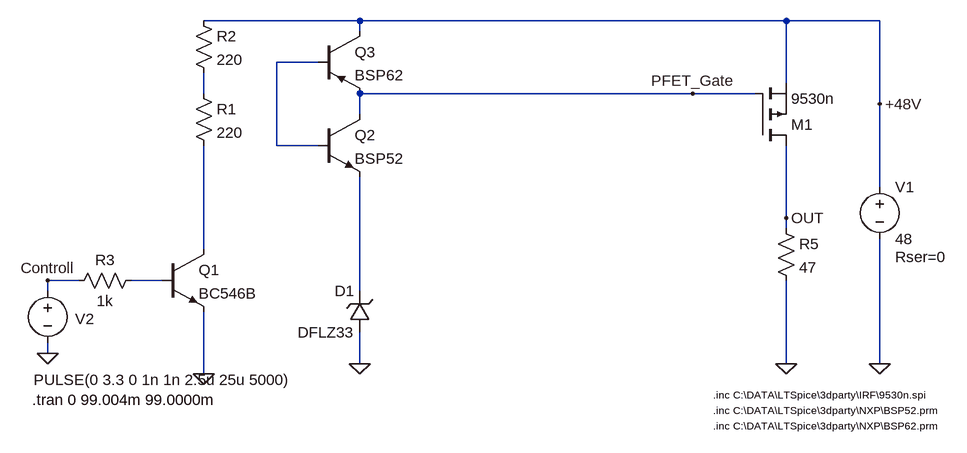
[diagram p0: schematic test002.asc]
test002.asc, the LTspice schematic file:
Version 4
SHEET 1 908 680
WIRE -144 -128 -384 -128
WIRE 512 -128 -144 -128
WIRE 656 -128 512 -128
WIRE -144 -112 -144 -128
WIRE -208 -64 -272 -64
WIRE 512 -32 512 -128
WIRE -384 -16 -384 -48
WIRE 368 -16 -144 -16
WIRE 464 -16 368 -16
WIRE 656 0 656 -128
WIRE -144 16 -144 -16
WIRE -272 64 -272 -64
WIRE -208 64 -272 64
WIRE 656 128 656 0
WIRE 512 176 512 64
WIRE 512 192 512 176
WIRE -384 224 -384 64
WIRE -576 272 -624 272
WIRE -448 272 -496 272
WIRE -624 288 -624 272
WIRE -144 288 -144 112
WIRE -624 384 -624 368
WIRE -144 400 -144 352
WIRE 512 400 512 272
WIRE 656 400 656 208
WIRE -384 416 -384 320
FLAG -144 400 0
FLAG 512 400 0
FLAG 656 400 0
FLAG -624 384 0
FLAG 656 0 +48V
FLAG -624 272 Controll
FLAG 512 176 OUT
FLAG 368 -16 PFET_Gate
FLAG -384 416 0
SYMBOL pmos 464 64 M180
SYMATTR InstName M1
SYMATTR Value 9530n
SYMATTR Prefix X
SYMBOL npn -208 16 R0
SYMATTR InstName Q2
SYMATTR Value BSP52
SYMATTR Prefix X
SYMBOL res 496 176 R0
SYMATTR InstName R5
SYMATTR Value 47
SYMBOL voltage 656 112 R0
WINDOW 123 0 0 Left 2
WINDOW 39 24 124 Left 2
SYMATTR SpiceLine Rser=0
SYMATTR InstName V1
SYMATTR Value 48
SYMBOL voltage -624 272 R0
WINDOW 0 42 59 Left 2
WINDOW 3 -22 153 Left 2
WINDOW 123 0 0 Left 2
WINDOW 39 0 0 Left 2
SYMATTR InstName V2
SYMATTR Value PULSE(0 3.3 0 1n 1n 2.5u 25u 5000)
SYMBOL zener -128 352 R180
WINDOW 0 24 64 Left 2
WINDOW 3 24 0 Left 2
SYMATTR InstName D1
SYMATTR Value DFLZ33
SYMATTR Description Diode
SYMATTR Type diode
SYMBOL pnp -208 -112 R0
SYMATTR InstName Q3
SYMATTR Value BSP62
SYMATTR Prefix X
SYMBOL res -400 -144 R0
SYMATTR InstName R2
SYMATTR Value 220
SYMBOL res -400 -32 R0
SYMATTR InstName R1
SYMATTR Value 220
SYMBOL npn -448 224 R0
SYMATTR InstName Q1
SYMATTR Value BC546B
SYMBOL res -480 256 R90
WINDOW 0 0 56 VBottom 2
WINDOW 3 32 56 VTop 2
SYMATTR InstName R3
SYMATTR Value 1k
TEXT -648 456 Left 2 !.tran 0 99.004m 99.0000m
TEXT 400 448 Left 1 !.inc C:\\DATA\\LTSpice\\3dparty\\IRF\\9530n.spi
TEXT 400 472 Left 1 !.inc C:\\DATA\\LTSpice\\3dparty\\NXP\\BSP52.prm
TEXT 400 496 Left 1 !.inc C:\\DATA\\LTSpice\\3dparty\\NXP\\BSP62.prm

The netlist it stands for:
* test002.asc
XM1 OUT PFET_Gate +48V 9530n  ; pins D G S
XQ2 PFET_Gate N001 N005 BSP52  ; pins C B E
R5 OUT 0 47
V1 +48V 0 48 Rser=0
V2 Controll 0 PULSE(0 3.3 0 1n 1n 2.5u 25u 5000)
D1 0 N005 DFLZ33
XQ3 +48V N001 PFET_Gate BSP62  ; pins C B E
R2 +48V N002 220
R1 N002 N003 220
Q1 N003 N004 0 0 BC546B
R3 N004 Controll 1k
.model D D
.lib standard.dio
.model NPN NPN
.model PNP PNP
.lib standard.bjt
.tran 0 99.004m 99.0000m
.inc C:\DATA\LTSpice\3dparty\IRF\9530n.spi
.inc C:\DATA\LTSpice\3dparty\NXP\BSP52.prm
.inc C:\DATA\LTSpice\3dparty\NXP\BSP62.prm
.backanno
.end